# EasyEDA schematic N2onboardTelemetry.json

## Sheets
1 Connectors: TITLE: Connectors; REV: 1.0; Date: 2022-01-05; Sheet: 1/1; Company: Nakuja
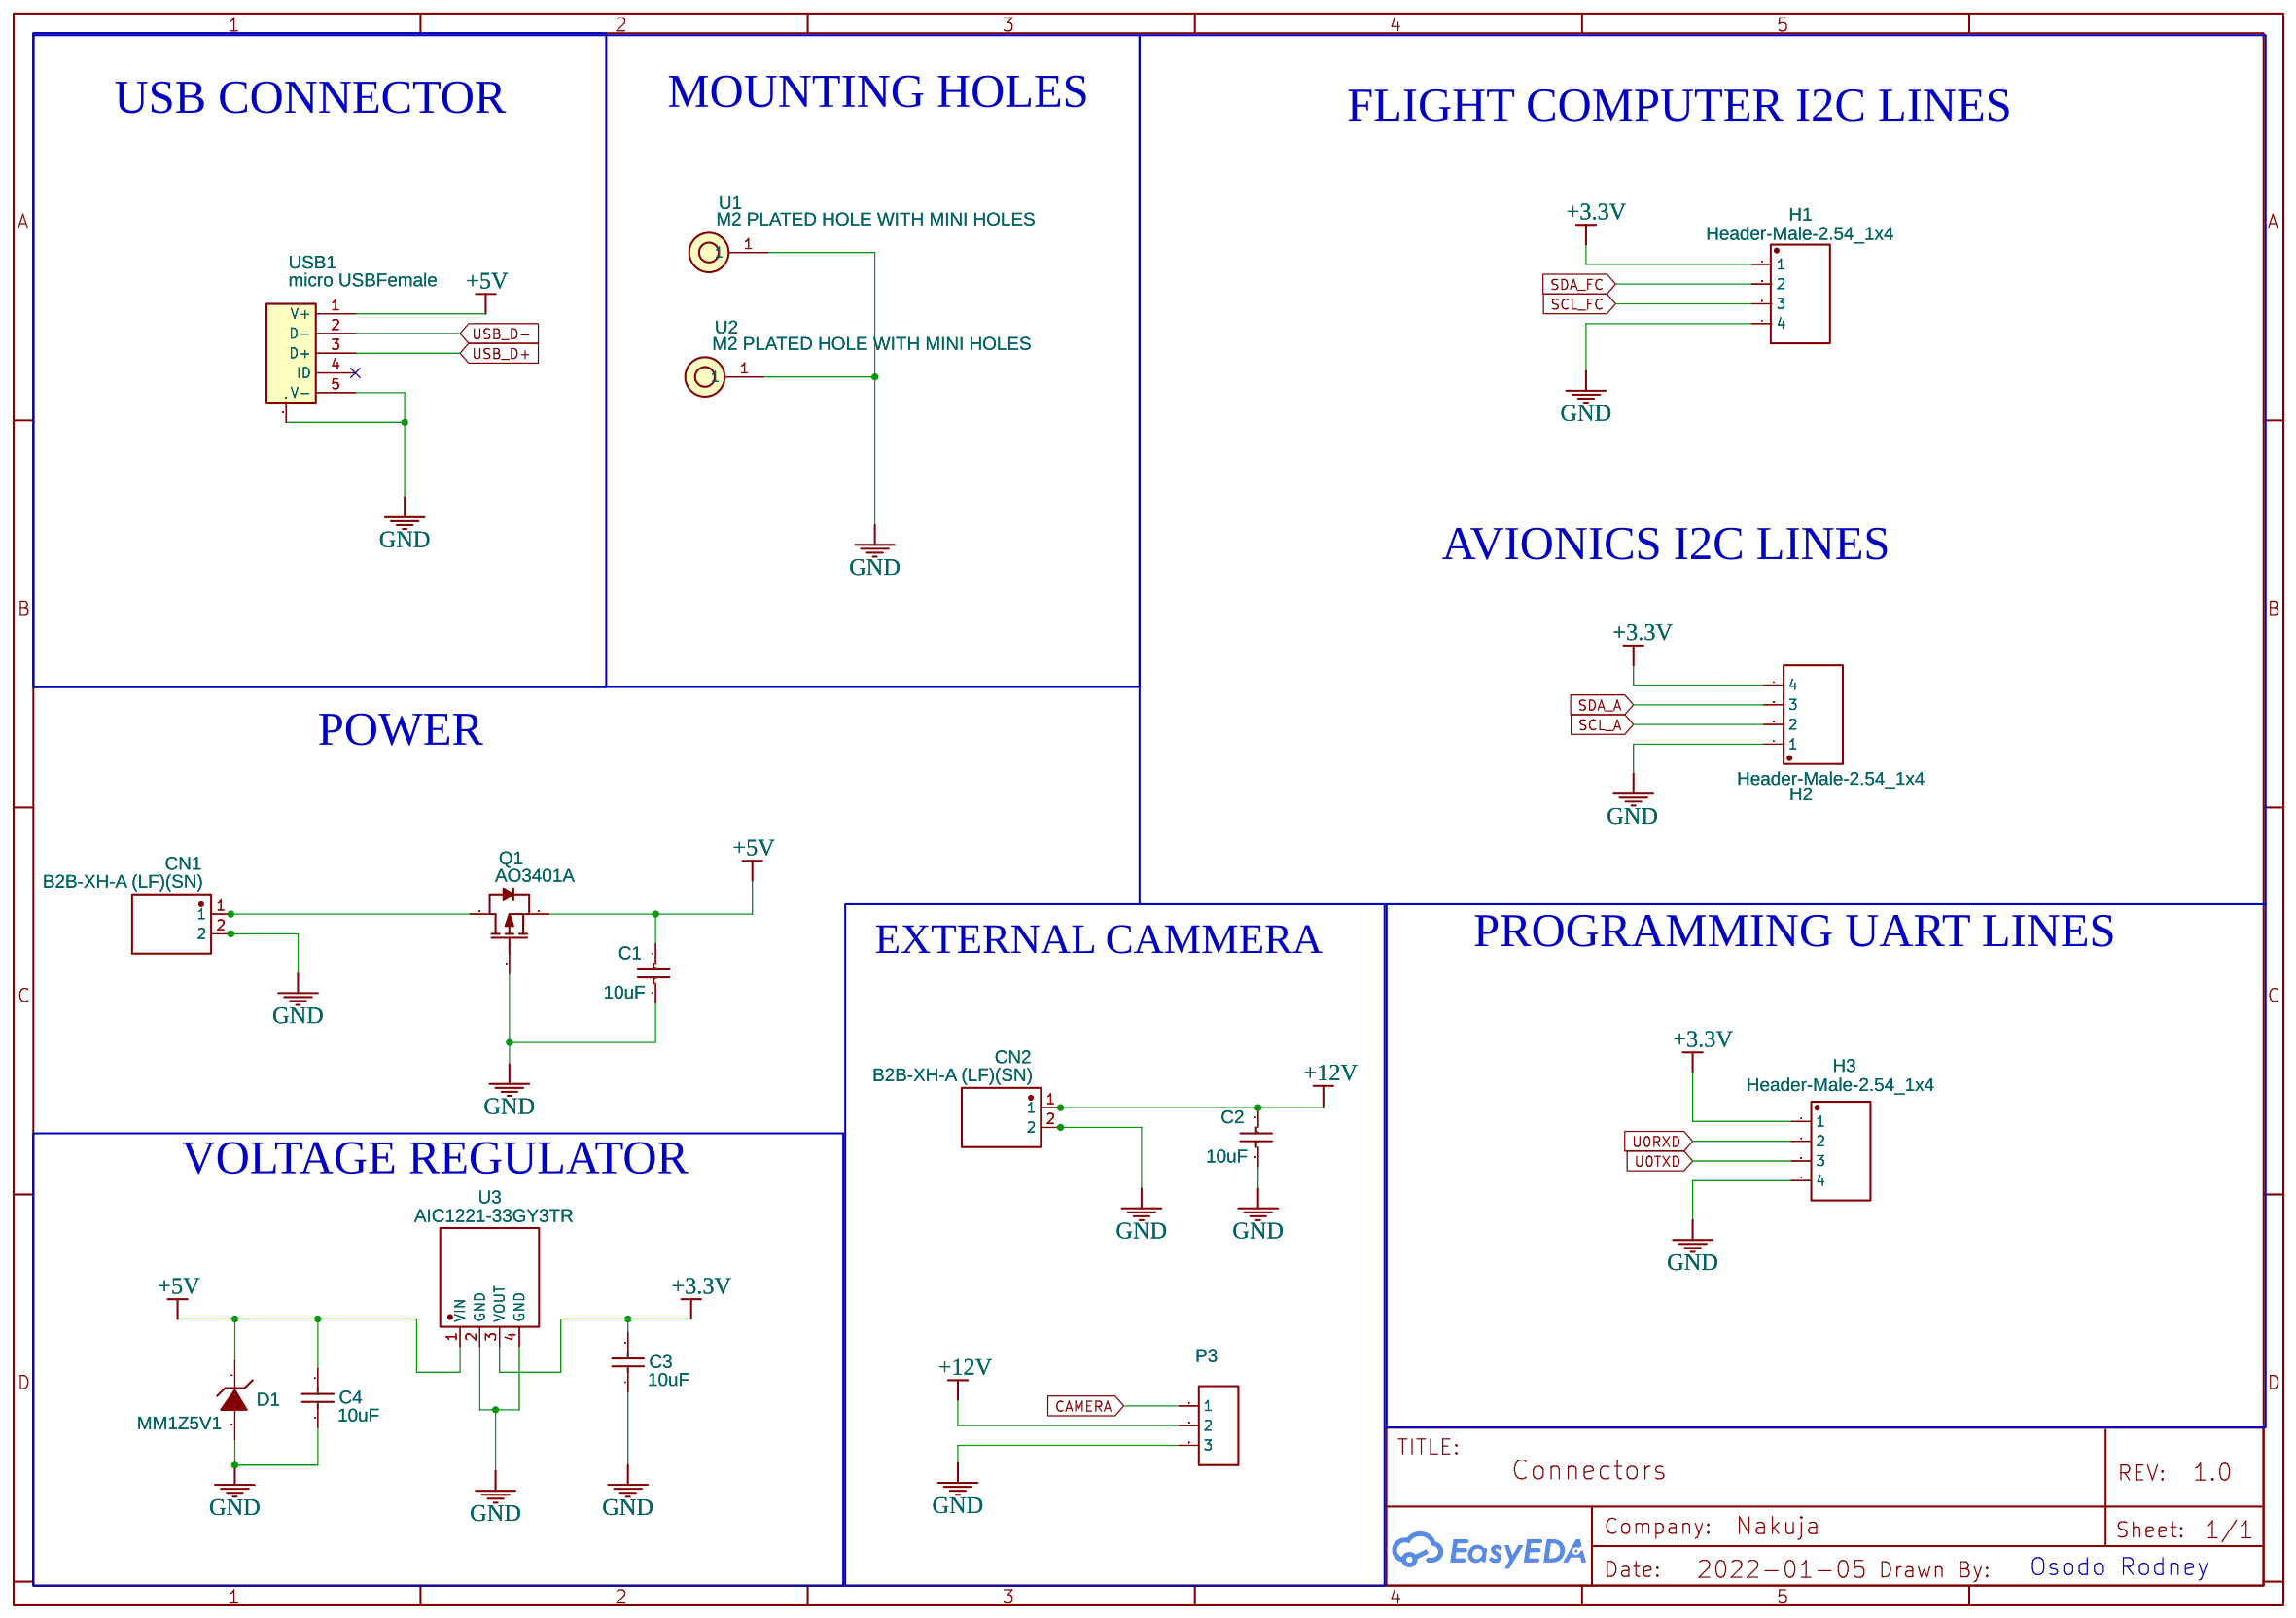
[diagram p0: Connectors]
2 lora&storage: TITLE: Lora and Storage; Date: 2022-02-04; Drawn By: Rodney Osodo
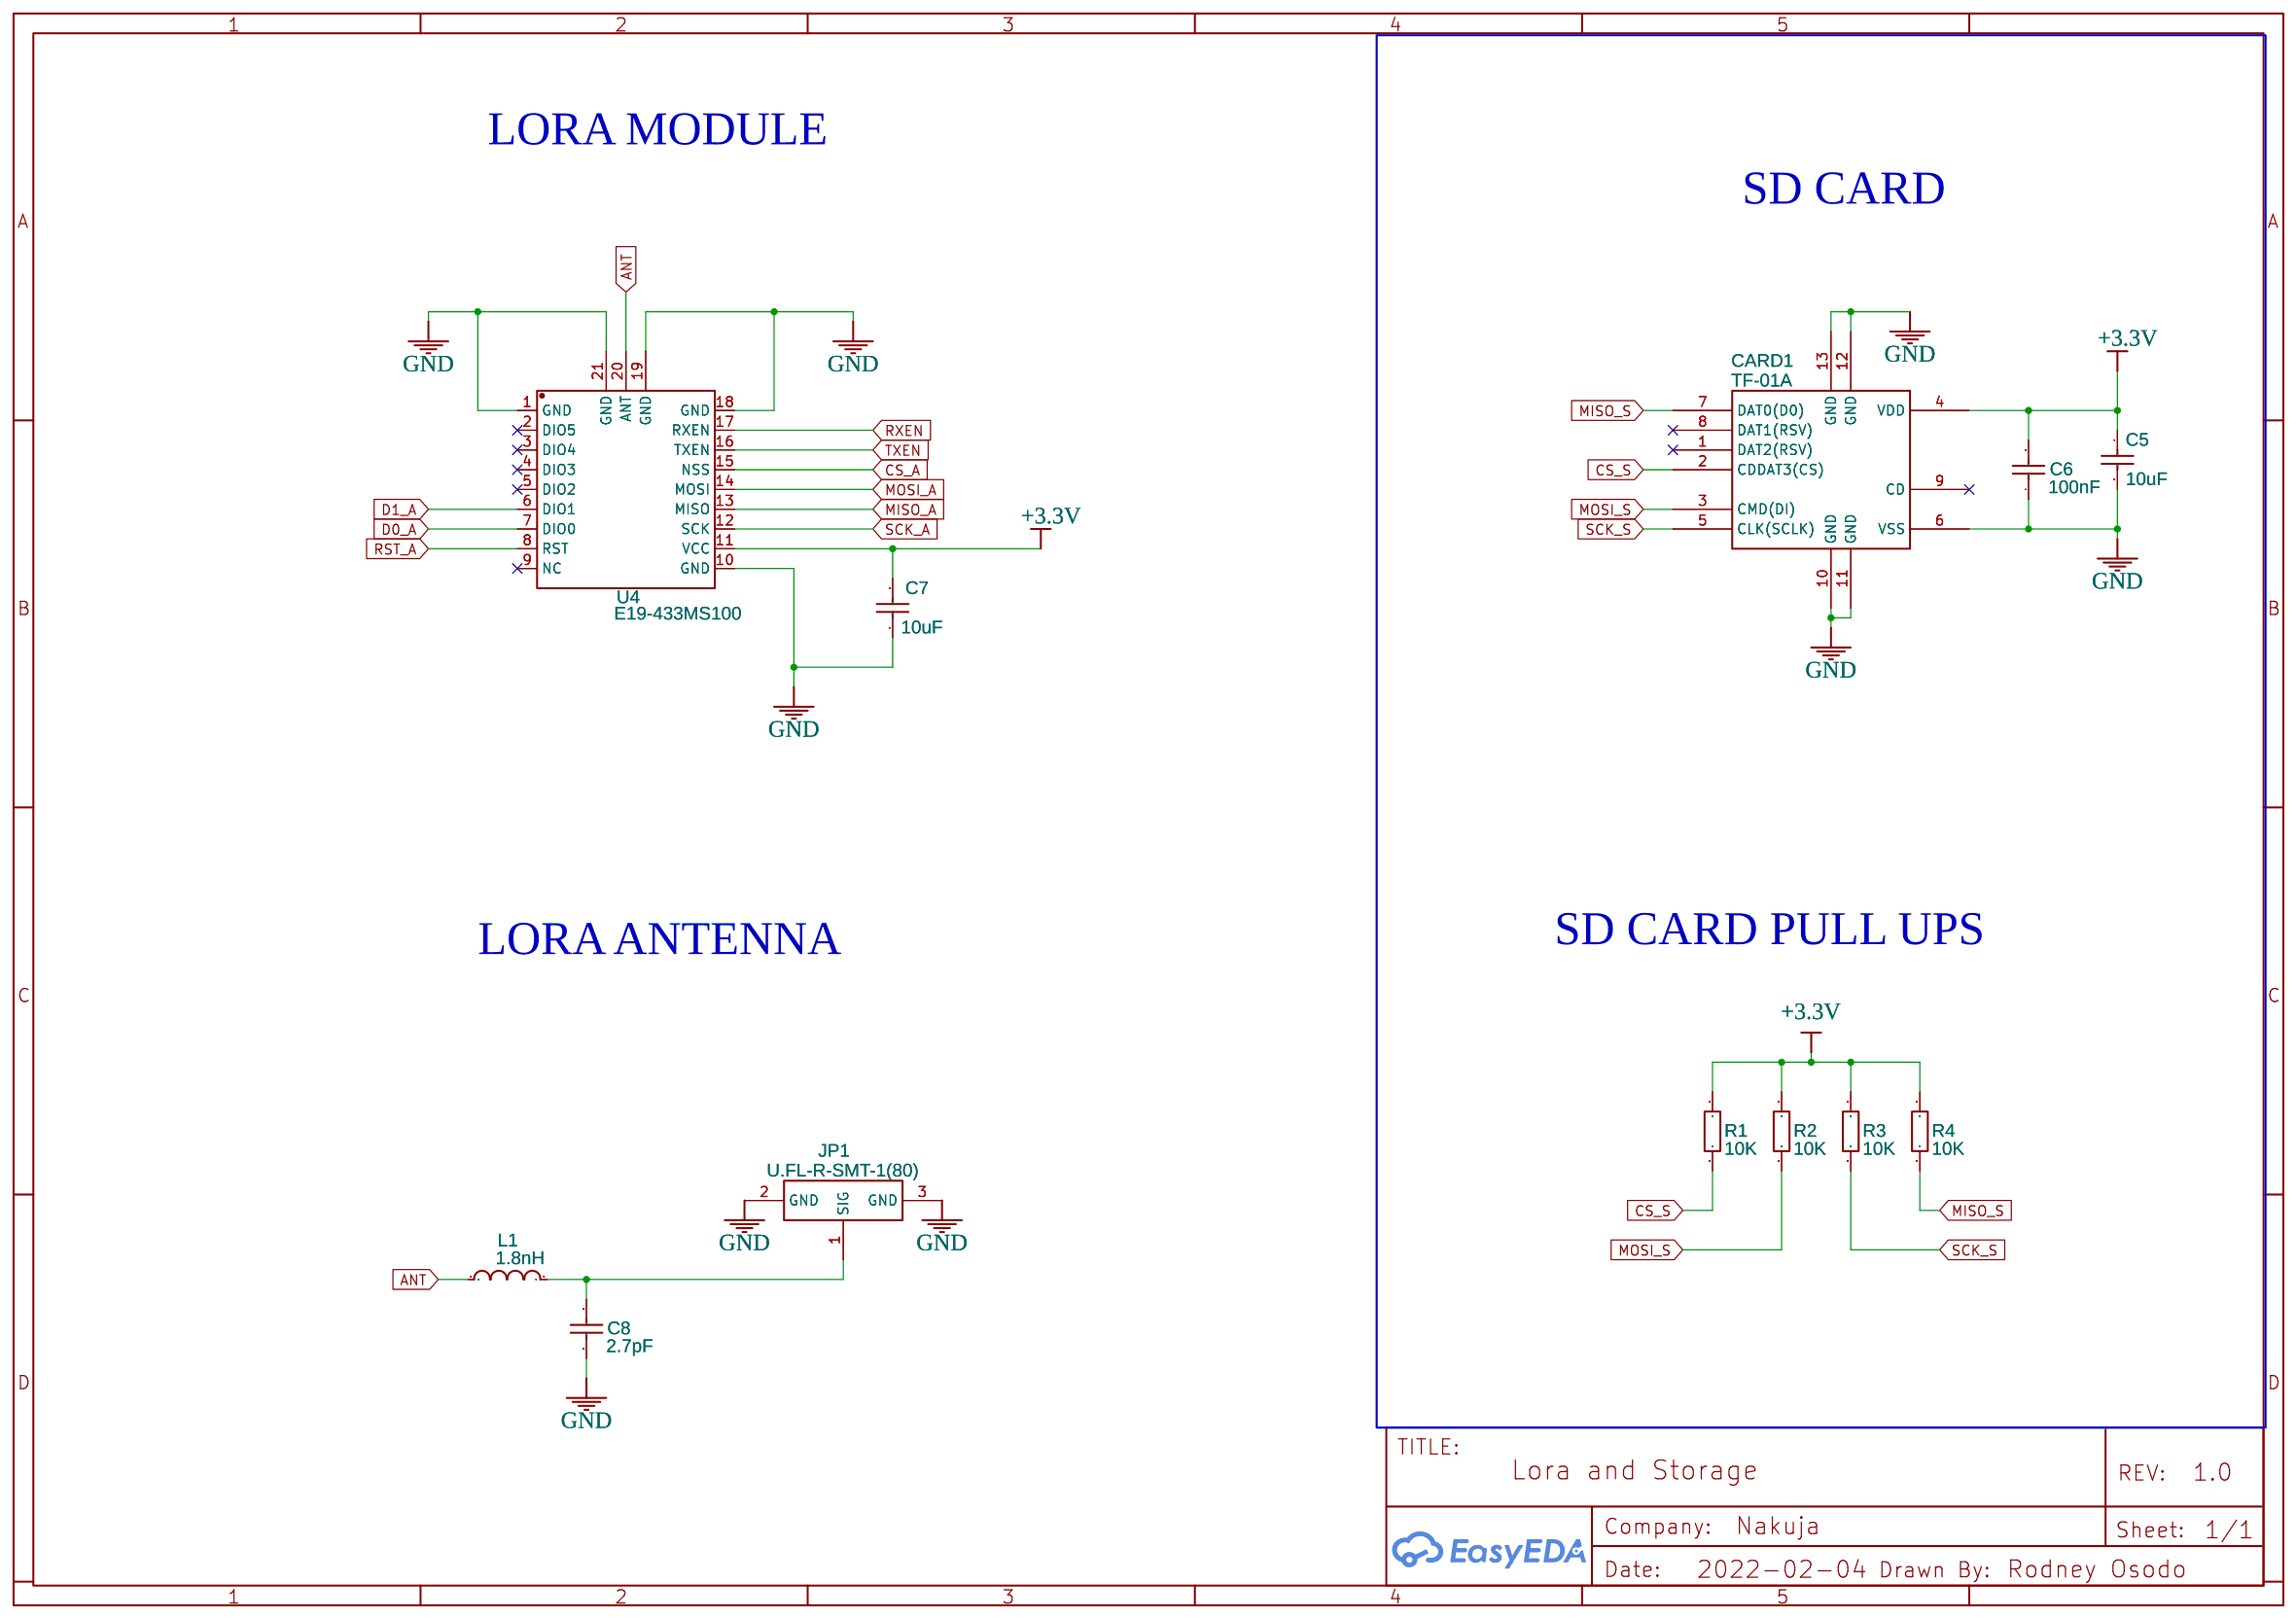
[diagram p1: lora&storage]
3 Peripherals: TITLE: MCU; Date: 2022-02-04; Drawn By: Rodney Osodo
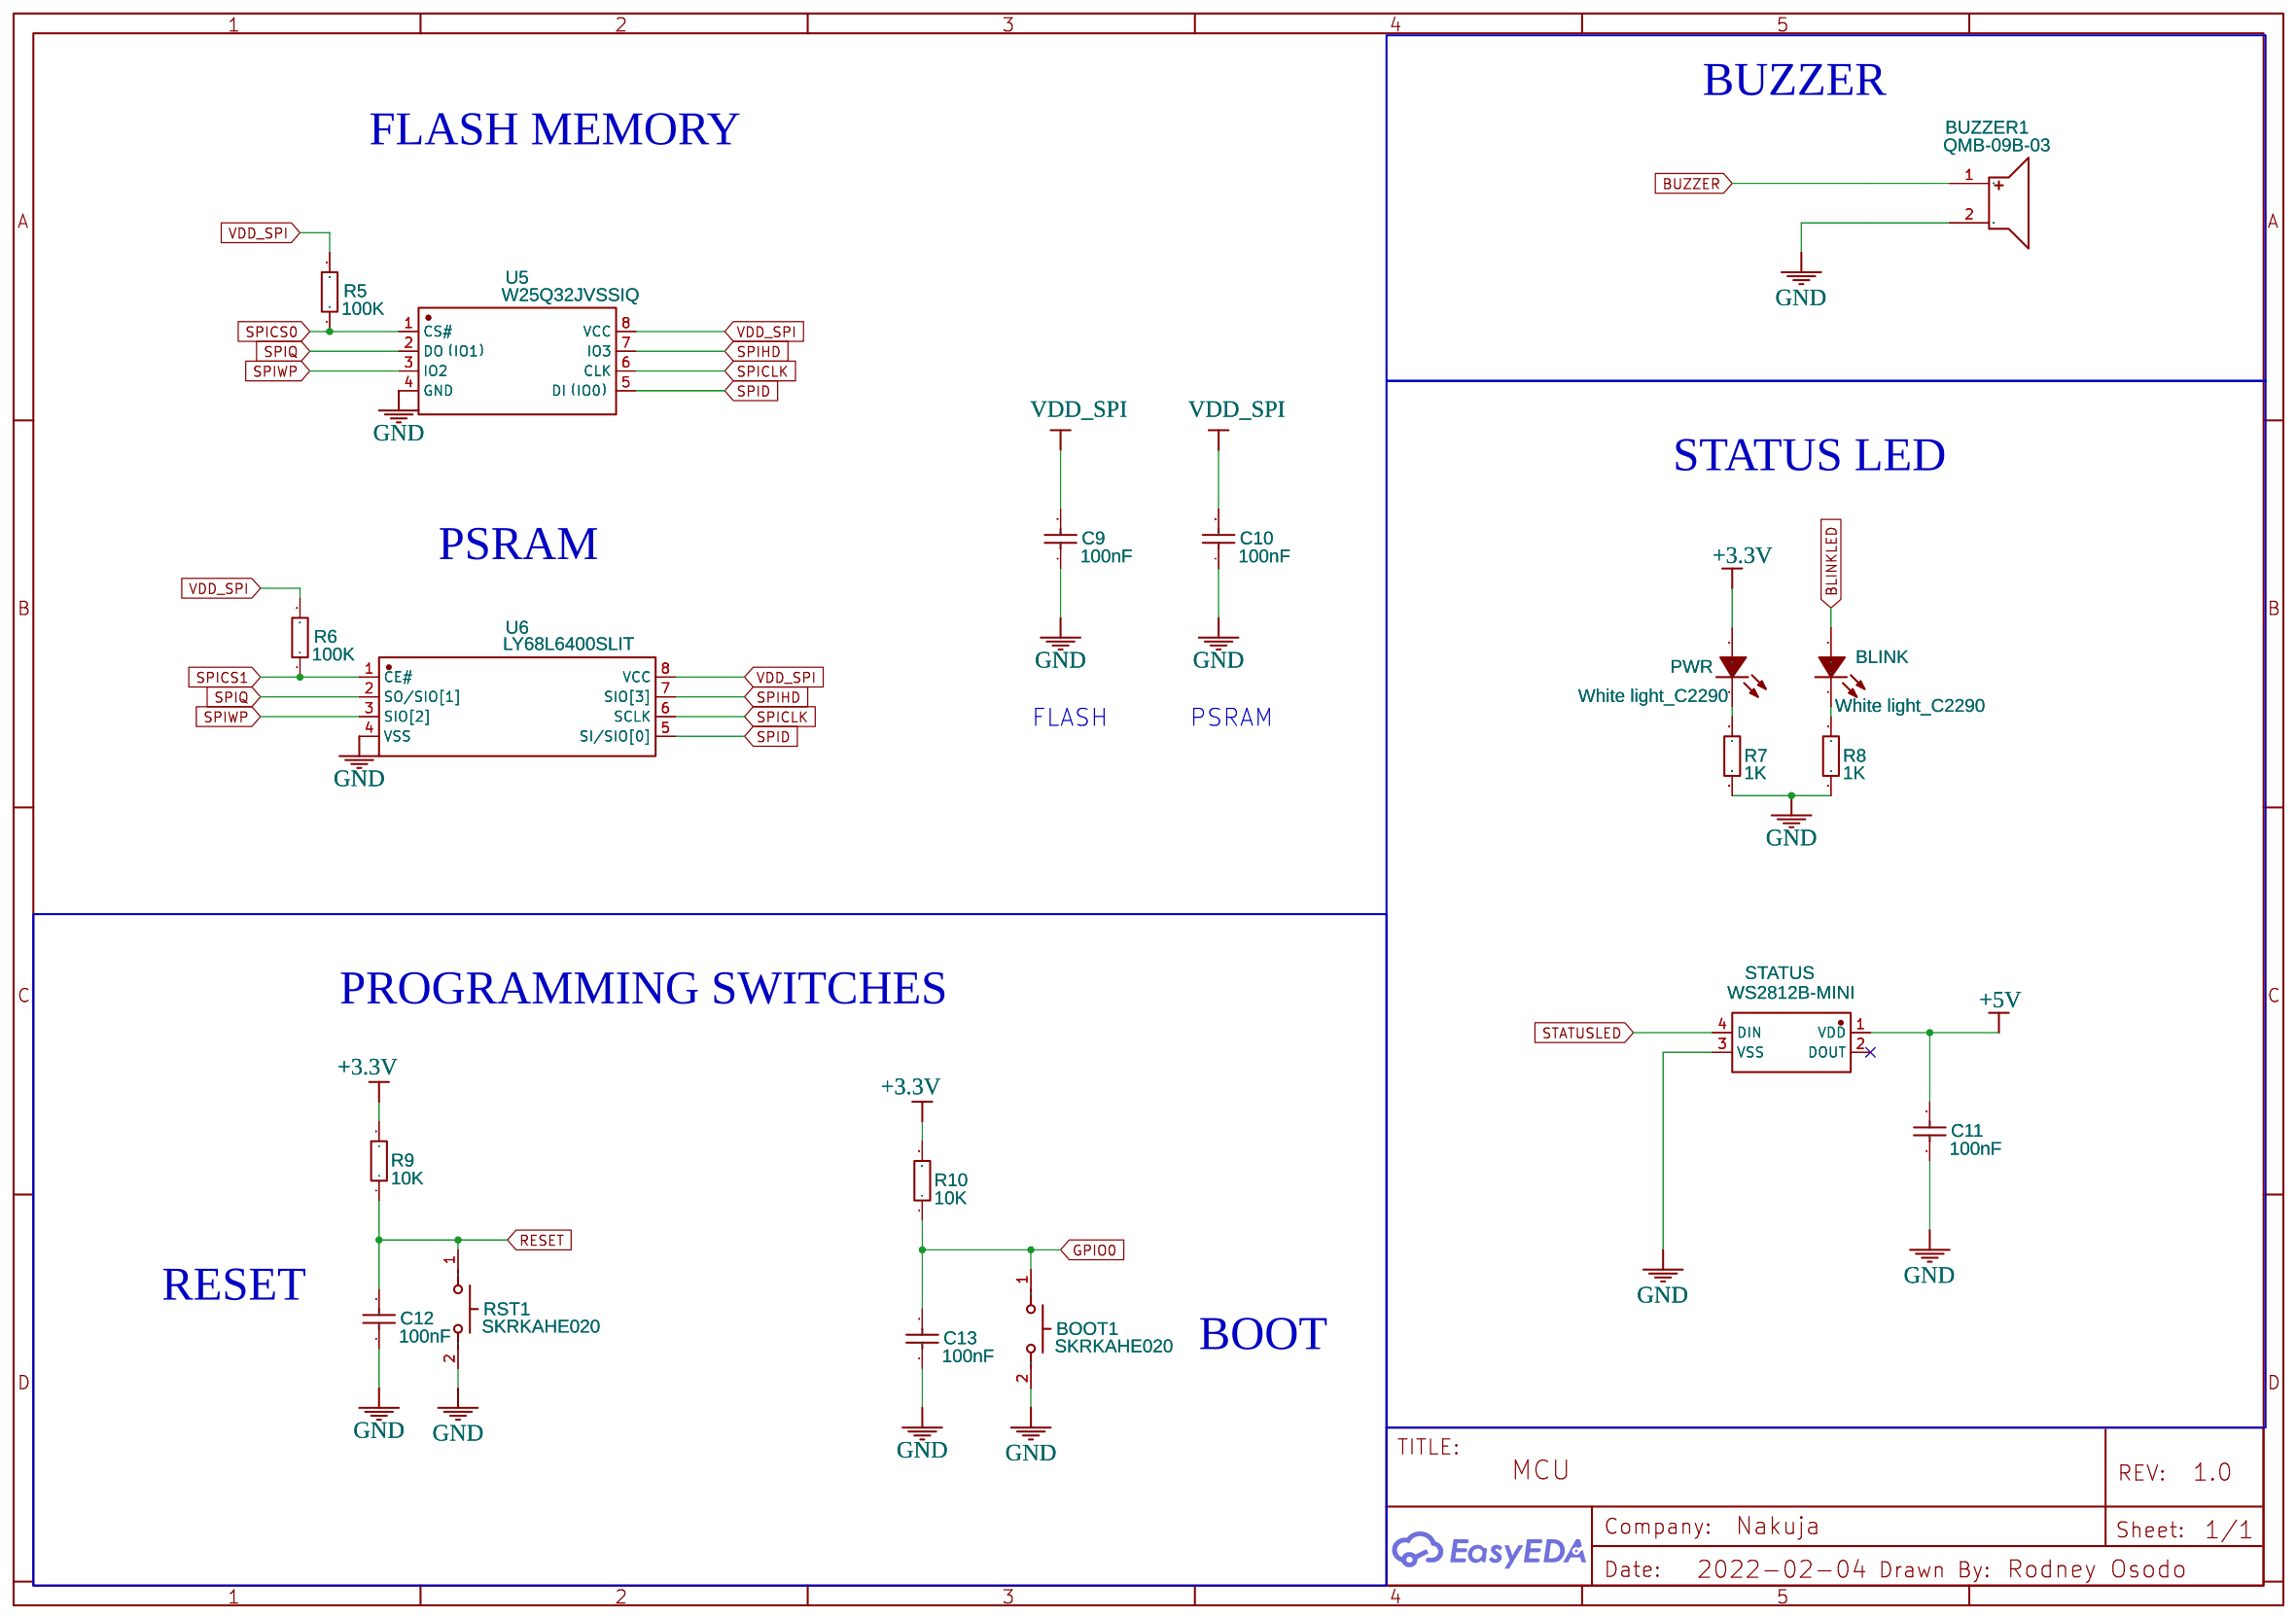
[diagram p2: Peripherals]
4 MCU: TITLE: Sheet_1; Date: 2022-03-04; Company: Your Company
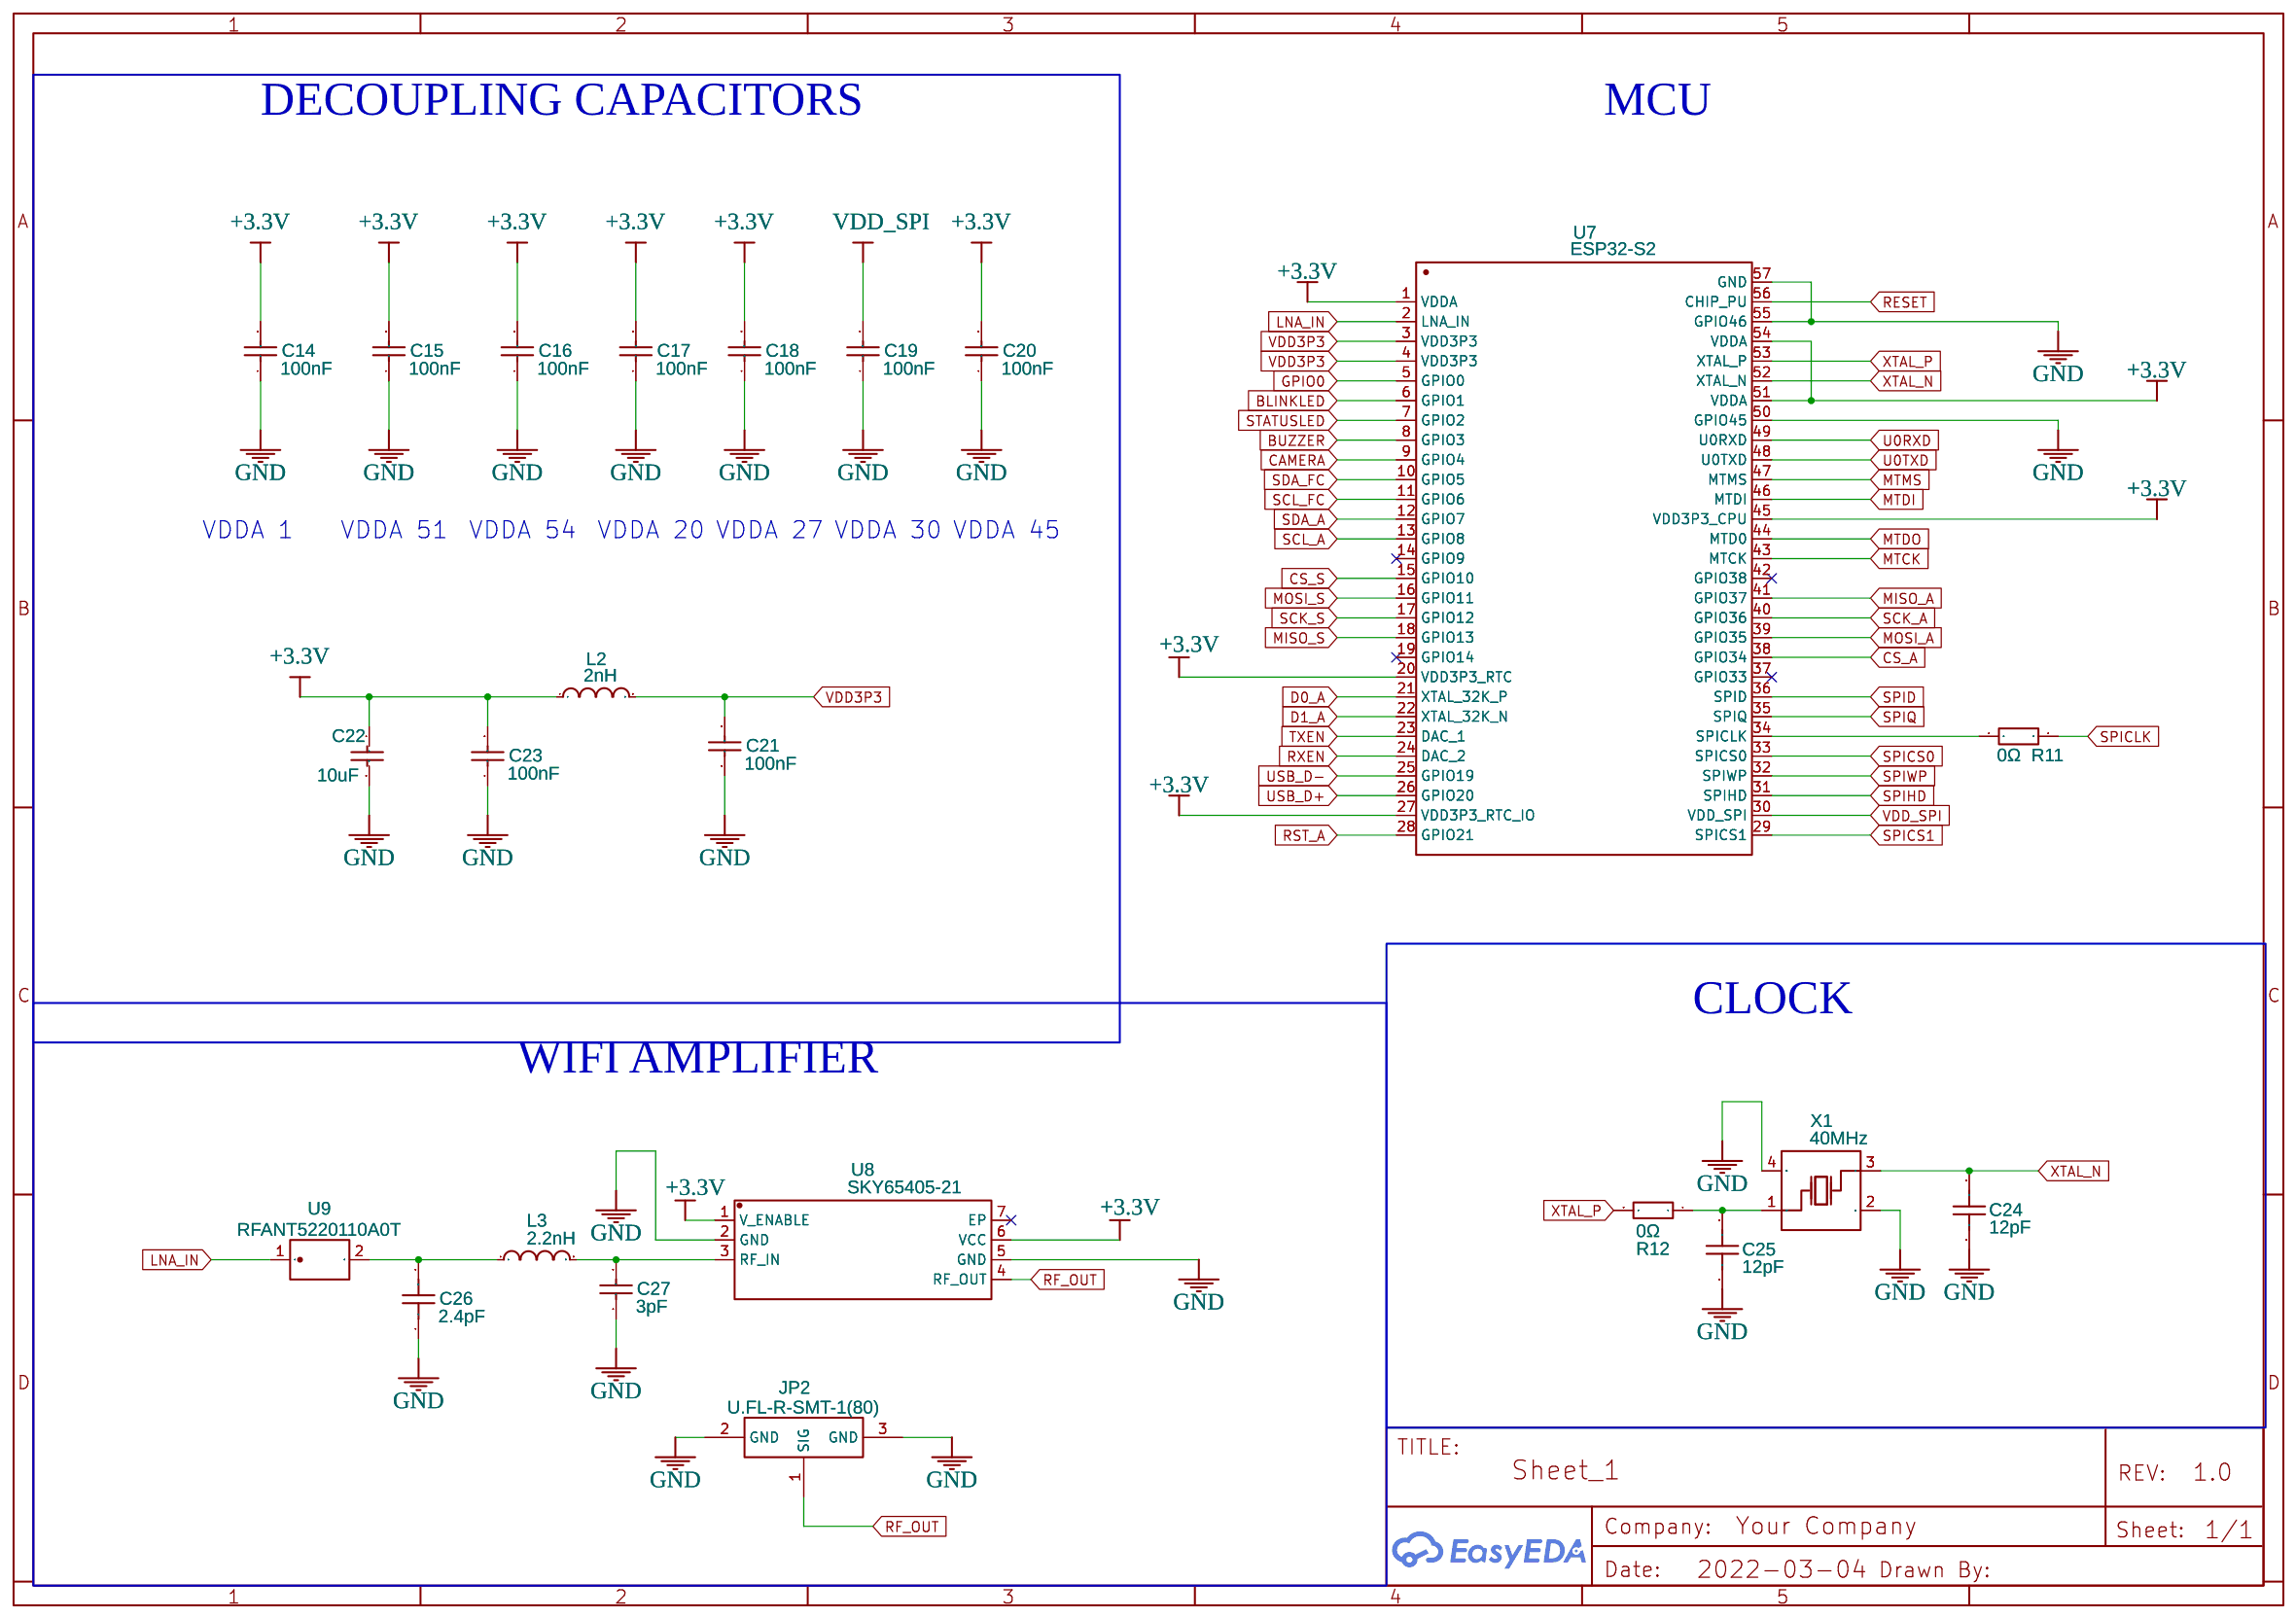
[diagram p3: MCU]
5 Debug: TITLE: Debug; Date: 2022-03-06; Drawn By: Rodney Osodo; Company: Your Company
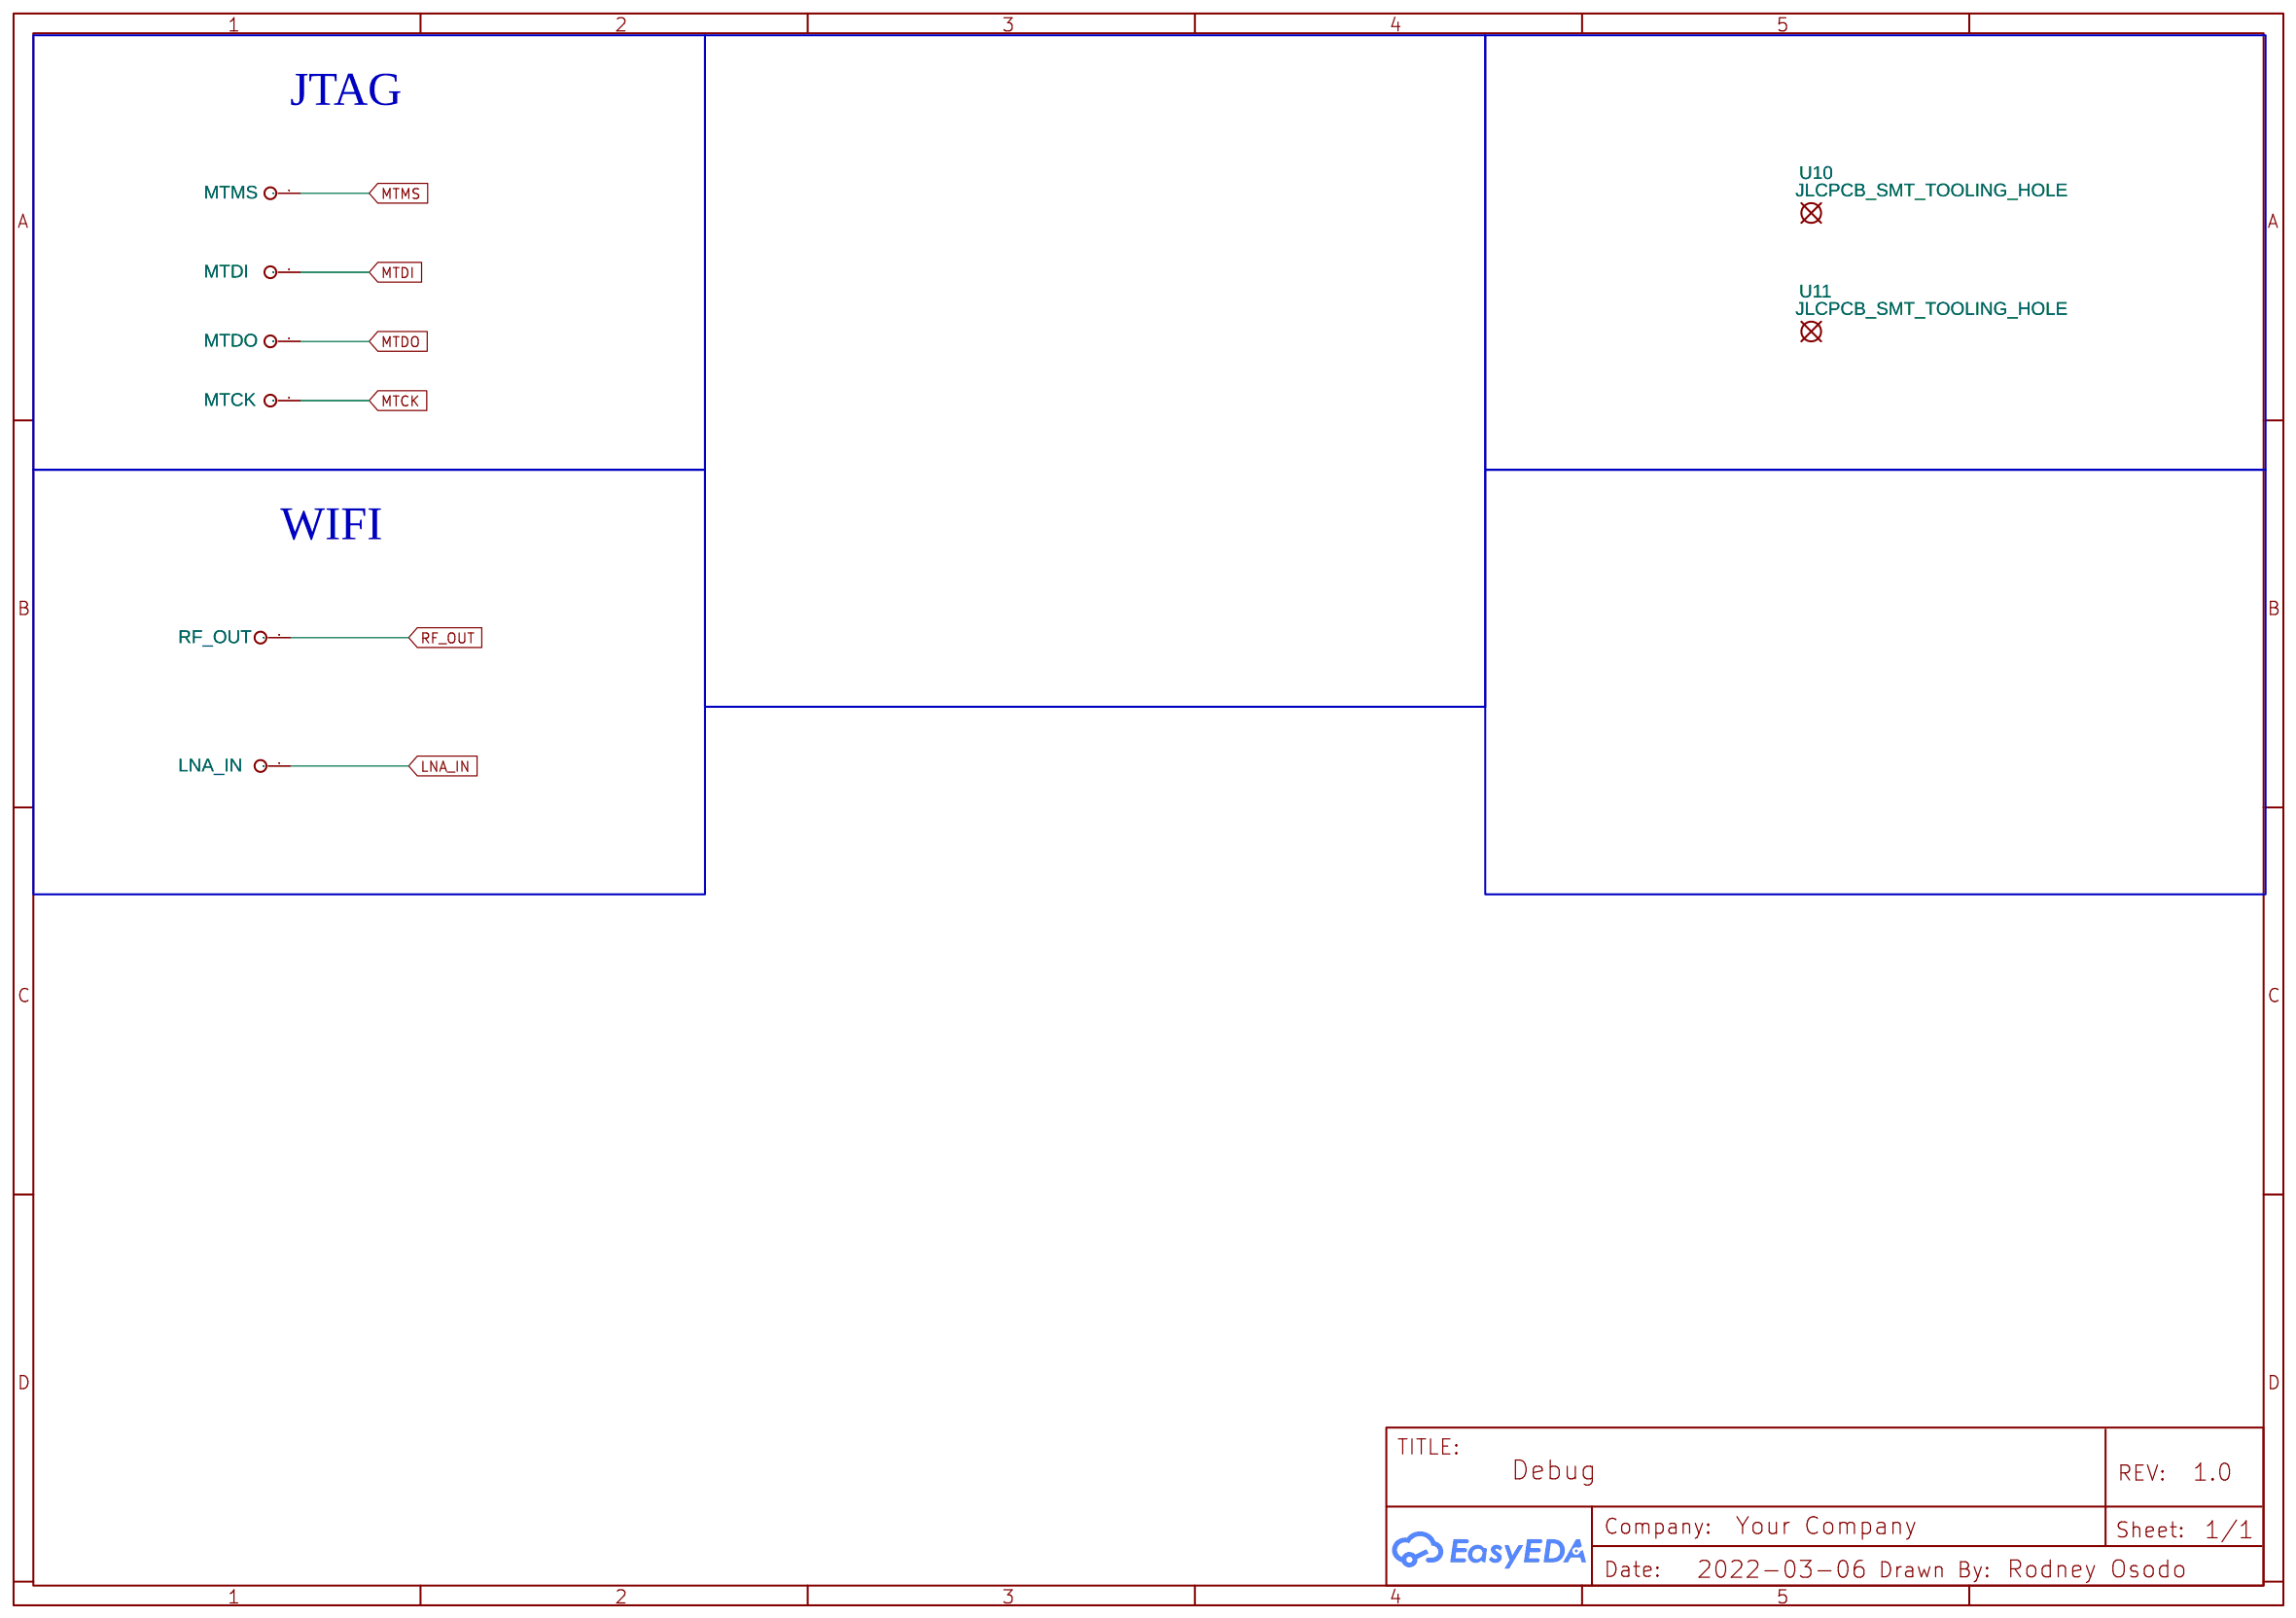
[diagram p4: Debug]

## Parts
sheet Connectors
C1  10uF  [C0402]
C2  10uF  [C0402]
C3  10uF  [C0402]
C4  10uF  [C0402]
CN1  B2B-XH-A (LF)(SN)  [CONN-TH_B2B-XH-A-LF-SN]
CN2  B2B-XH-A (LF)(SN)  [CONN-TH_B2B-XH-A-LF-SN]
D1  MM1Z5V1  [SOD-123_L2.7-W1.6-LS3.7-RD]
H1  Header-Male-2.54_1x4  [HDR-TH_4P-P2.54-V-M]
H2  Header-Male-2.54_1x4  [HDR-TH_4P-P2.54-V-M]
H3  Header-Male-2.54_1x4  [HDR-TH_4P-P2.54-V-M]
P3  HEADER-PINS_2.54_03PIN_01ROW COPY  [HEADER-PINS_2.54_04PIN_01ROW]
Q1  AO3401A  [SOT-23_L2.9-W1.3-P1.90-LS2.4-BR]
U1  M2 PLATED HOLE WITH MINI HOLES  [M2 PLATED HOLE WITH MINI HOLES]
U2  M2 PLATED HOLE WITH MINI HOLES  [M2 PLATED HOLE WITH MINI HOLES]
U3  AIC1221-33GY3TR  [SOT-223_L6.5-W3.5-P2.30-LS7.0-BR]
USB1  micro USBFemale  [MICRO-USB-SMD_5P-P0.65-H-F_C10418]
sheet Debug
LNA_IN  TESTPOINT_1MM  [TESTPOINT_1MM]
MTCK  TESTPOINT_1MM  [TESTPOINT_1MM]
MTDI  TESTPOINT_1MM  [TESTPOINT_1MM]
MTDO  TESTPOINT_1MM  [TESTPOINT_1MM]
MTMS  TESTPOINT_1MM  [TESTPOINT_1MM]
RF_OUT  TESTPOINT_1MM  [TESTPOINT_1MM]
U10  JLCPCB_SMT_TOOLING_HOLE  [JLCPCB_SMT_TOOLING_HOLE]
U11  JLCPCB_SMT_TOOLING_HOLE  [JLCPCB_SMT_TOOLING_HOLE]
sheet lora&storage
C5  10uF  [C0402]
C6  100nF  [C0402_NEW]
C7  10uF  [C0402]
C8  2.7pF  [C0402]
CARD1  TF-01A  [TF-SMD_TF-01A]
JP1  U.FL-R-SMT-1(80)  [RF-SMD_734120114]
L1  1.8nH  [L0402]
R1  10K  [R0402]
R2  10K  [R0402]
R3  10K  [R0402]
R4  10K  [R0402]
U4  E19-433MS100  [WIRELM-SMD_E19-433M20SC]
sheet MCU
C14  100nF  [C0402_NEW]
C15  100nF  [C0402_NEW]
C16  100nF  [C0402_NEW]
C17  100nF  [C0402_NEW]
C18  100nF  [C0402_NEW]
C19  100nF  [C0402_NEW]
C20  100nF  [C0402_NEW]
C21  100nF  [C0402_NEW]
C22  10uF  [C0402]
C23  100nF  [C0402_NEW]
C24  12pF  [C0402]
C25  12pF  [C0402]
C26  2.4pF  [C0402]
C27  3pF  [C0402]
JP2  U.FL-R-SMT-1(80)  [RF-SMD_734120114]
L2  2nH  [L0402]
L3  2.2nH  [L0402]
R11  0Ω  [R0402]
R12  0Ω  [R0402]
U7  ESP32-S2  [QFN-56_L7.0-W7.0-P0.40-TL-EP4.0]
U8  SKY65405-21  [DFN-6_L1.5-W1.5-P0.50-BL-EP1.2]
U9  RFANT5220110A0T  [FILTER-SMD_L5.2-W2.0-L]
X1  40MHz  [CRYSTAL-SMD_4P-L3.2-W2.5-BL]
sheet Peripherals
BLINK  White light_C2290  [LED0603-R-RD_WHITE]
BOOT1  SKRKAHE020  [SW-SMD_L3.9-W3.0-P4.45]
BUZZER1  QMB-09B-03  [BUZ-TH_BD9.0-P4.00-D0.6-FD]
C9  100nF  [C0402_NEW]
C10  100nF  [C0402_NEW]
C11  100nF  [C0402_NEW]
C12  100nF  [C0402_NEW]
C13  100nF  [C0402_NEW]
PWR  White light_C2290  [LED0603-R-RD_WHITE]
R5  100K  [R0402]
R6  100K  [R0402]
R7  1K  [R0402]
R8  1K  [R0402]
R9  10K  [R0402]
R10  10K  [R0402]
RST1  SKRKAHE020  [SW-SMD_L3.9-W3.0-P4.45]
STATUS  WS2812B-MINI  [LED-SMD_4P-L3.5-W3.5-TL_WS2812B]
U5  W25Q32JVSSIQ  [SOIC-8_L5.3-W5.3-P1.27-LS8.0-BL]
U6  LY68L6400SLIT  [SOP-8_L4.9-W3.9-P1.27-LS6.0-BL]

## Library data of the parts
C1 C2 C5 C7 C22 = CL05A106MQ5NUNC: Supplier: LCSC; Manufacturer: SAMSUNG; Supplier Part: C15525; SMT Type: Basic; JLCPCB SMD: Yes; LCSC Assembly: Yes; Paste Type: base
C3 C4 = CL05A106MQ5NUNC: Supplier: LCSC; Manufacturer: SAMSUNG; Supplier Part: C15525; JLCPCB Part Class: Basic Part
CN1 CN2 = B2B-XH-A (LF)(SN): Supplier: LCSC; Supplier Part: C158012; Manufacturer: JST Sales America; Contributor: LCSC; JLCPCB Part Class: Extended Part
D1 = MM1Z5V1: Supplier: LCSC; Manufacturer: SEMTECH; Supplier Part: C81601; JLCPCB Part Class: Extended Part
H1-H3 = Header-Male-2.54_1x4: Supplier: LCSC; Manufacturer: Ckmtw; Manufacturer Part: 210S-1*4P L=11.6MMGold-plated black; Contributor: LCSC; Supplier Part: C124378; JLCPCB Part Class: Extended Part
P3 = HEADER-PINS_2.54_03PIN_01ROW COPY: Contributor: FTI-Pilatus-Aircraft
Q1 = AO3401A: Supplier: LCSC; Manufacturer: AOS; Supplier Part: C15127; JLCPCB Part Class: Basic Part
U1 U2 = M2 PLATED HOLE WITH MINI HOLES: Contributor: Andrew Young
U3 = AIC1221-33GY3TR: Supplier: LCSC; Supplier Part: C211622; Manufacturer: Analog Integrations; Contributor: LCSC; JLCPCB Part Class: Extended Part
USB1 = micro USBFemale: Supplier: LCSC; Manufacturer: ValuePro; Supplier Part: C10418; JLCPCB Part Class: Extended Part
LNA_IN MTCK MTDI MTDO MTMS RF_OUT = TESTPOINT_1MM: Contributor: LCSC
U10 U11 = JLCPCB_SMT_TOOLING_HOLE: Supplier: LCSC; Contributor: yjzhang
C6 C9-C21 C23 = CL05B104KO5NNNC: Supplier: LCSC; Manufacturer: SAMSUNG; Supplier Part: C1525; JLCPCB Part Class: Basic Part
C8 = 0402CG2R7C500NT: Supplier: LCSC; Manufacturer: FH; Supplier Part: C1561; JLCPCB Part Class: Basic Part
CARD1 = TF-01A: Supplier: LCSC; Manufacturer: HRO; Supplier Part: C91145; JLCPCB Part Class: Extended Part
JP1 JP2 = U.FL-R-SMT-1(80): Supplier: LCSC; Manufacturer: HRS; Supplier Part: C88374; JLCPCB Part Class: Extended Part
L1 = HK10051N8S-T: Supplier: LCSC; Manufacturer: TAIYO YUDEN; Supplier Part: C89157
R1-R4 R9 R10 = RTT02103JTH: Supplier: LCSC; Manufacturer: RALEC; Supplier Part: C102759; JLCPCB Part Class: Extended Part
U4 = E19-433MS100: Supplier: LCSC; Supplier Part: C97346; Manufacturer: Chengdu Ebyte Elec Tech; Contributor: LCSC; JLCPCB Part Class: Extended Part
C24 C25 = 0402N120F500CT: Supplier: LCSC; Supplier Part: C555399; Manufacturer: Walsin Tech Corp; Contributor: LCSC
C26 = 0402N2R4B500: Supplier: LCSC; Supplier Part: C123475; Manufacturer: Huaxin S&T; Contributor: LCSC; JLCPCB Part Class: Extended Part
C27 = CL05C030BB5NNNC: Supplier: LCSC; Supplier Part: C318583; Manufacturer: Samsung Electro-Mechanics; Contributor: LCSC; JLCPCB Part Class: Extended Part
L2 = MLG1005S2N0BT000: Supplier: LCSC; Supplier Part: C76769; Manufacturer: TDK; Contributor: LCSC; JLCPCB Part Class: Extended Part
L3 = SDCL1005C2N2STDF: Supplier: LCSC; Manufacturer: Sunlord; Supplier Part: C27122; JLCPCB Part Class: Extended Part
R11 R12 = RC-02000FT: Supplier: LCSC; Supplier Part: C140225; Manufacturer: Guangdong Fenghua Advanced Tech; Resistance (Ohms): 0; Contributor: LCSC; JLCPCB Part Class: Extended Part
U7 = ESP32-S2: Supplier: LCSC; Supplier Part: C529594; Manufacturer: ESPRESSIF 乐鑫; Contributor: LCSC; JLCPCB Part Class: Extended Part
U8 = SKY65405-21: Supplier: LCSC; Supplier Part: C80314; Manufacturer: Skyworks Solutions; Contributor: LCSC; JLCPCB Part Class: Extended Part
U9 = RFANT5220110A0T: Supplier: LCSC; Supplier Part: C127611; Manufacturer: Walsin Tech Corp; Frequency: 2.4GHz; Contributor: LCSC; JLCPCB Part Class: Extended Part
X1 = S3240000121040: Supplier: LCSC; Supplier Part: C426989; Manufacturer: JGHC; Contributor: LCSC; JLCPCB Part Class: Extended Part
BLINK PWR = 0603White light_C2290: Supplier: LCSC; Manufacturer: KENTO; Manufacturer Part: 0603White light; Supplier Part: C2290; JLCPCB Part Class: Basic Part
BOOT1 RST1 = SKRKAHE020: Supplier: LCSC; Supplier Part: C202388; Manufacturer: ALPS Electric; Contributor: LCSC
BUZZER1 = QMB-09B-03: Supplier: LCSC; Manufacturer: HNDZ; Contributor: LCSC; Supplier Part: C96256; JLCPCB Part Class: Extended Part
R5 R6 = 0402WGF1003TCE: Supplier: LCSC; Manufacturer: UniOhm; Supplier Part: C25741; JLCPCB Part Class: Basic Part
R7 R8 = 0402WGF5101TCE: Supplier: LCSC; Manufacturer: UniOhm; Supplier Part: C25905; JLCPCB Part Class: Basic Part
STATUS = WS2812B-MINI: Supplier: LCSC; Supplier Part: C527089; Manufacturer: Worldsemi; Manufacturer Part: WS2812B-Mini; Contributor: LCSC; JLCPCB Part Class: Extended Part
U5 = W25Q32JVSSIQ: Supplier: LCSC; Manufacturer: WINBOND; Supplier Part: C82344; JLCPCB Part Class: Extended Part
U6 = LY68L6400SLIT: Supplier: LCSC; Supplier Part: C261881; Manufacturer: Lyontek Inc.; Contributor: LCSC; JLCPCB Part Class: Extended Part

## Nets
+3.3V: C3.2 C5.1 C6.2 C7.1 C14.2 C15.2 C16.2 C17.2 C18.2 C20.2 C22.1 C23.2 CARD1.4(VDD) H1.1 H2.4 H3.1 L2.1 PWR.1(A) R1.2 R2.2 R3.2 R4.2 R9.2 R10.2 U3.3(VOUT) U4.11(VCC) U7.1(VDDA) U7.20(VDD3P3_RTC) U7.27(VDD3P3_RTC_IO) U7.45(VDD3P3_CPU) U7.51(VDDA) U7.54(VDDA) U8.1(V_ENABLE) U8.6(VCC)
+5V: C1.1 C4.2 C11.2 D1.1(C) Q1.2(S) STATUS.1(VDD) U3.1(VIN) USB1.1(V+)
+12V: C2.1 CN2.1 P3.2
GND: BOOT1.2 BUZZER1.2 C1.2 C2.2 C3.1 C4.1 C5.2 C6.1 C7.2 C8.1 C9.1 C10.1 C11.1 C12.1 C13.1 C14.1 C15.1 C16.1 C17.1 C18.1 C19.1 C20.1 C21.1 C22.2 C23.1 C24.1 C25.1 C26.1 C27.1 CARD1.6(VSS) CARD1.10(GND) CARD1.11(GND) CARD1.12(GND) CARD1.13(GND) CN1.2 CN2.2 D1.2(A) H1.4 H2.1 H3.4 JP1.2(GND) JP1.3(GND) JP2.2(GND) JP2.3(GND) P3.3 Q1.1(G) R7.2 R8.1 RST1.2 STATUS.3(VSS) U1.1 U2.1 U3.2(GND) U3.4(GND) U4.1(GND) U4.10(GND) U4.18(GND) U4.19(GND) U4.21(GND) U5.4(GND) U6.4(VSS) U7.50(GPIO45) U7.55(GPIO46) U7.57(GND) U8.2(GND) U8.5(GND) USB1.0(MTN) USB1.5(V-) X1.2(GND) X1.4(GND)
VDD3P3: C21.2 L2.2 U7.3(VDD3P3) U7.4(VDD3P3)
VDD_SPI: C9.2 C10.2 C19.2 R5.2 R6.2 U5.8(VCC) U6.8(VCC) U7.30(VDD_SPI)
ANT: L1.1 U4.20(ANT)
BLINKLED: BLINK.1(A) U7.6(GPIO1)
BUZZER: BUZZER1.1 U7.8(GPIO3)
CAMERA: P3.1 U7.9(GPIO4)
CS_A: U4.15(NSS) U7.38(GPIO34)
CS_S: CARD1.2(CDDAT3(CS)) R1.1 U7.15(GPIO10)
D0_A: U4.7(DIO0) U7.21(XTAL_32K_P)
D1_A: U4.6(DIO1) U7.22(XTAL_32K_N)
GPIO0: BOOT1.1 C13.2 R10.1 U7.5(GPIO0)
LNA_IN: LNA_IN.1 U7.2(LNA_IN) U9.1
MISO_A: U4.13(MISO) U7.41(GPIO37)
MISO_S: CARD1.7(DAT0(D0)) R4.1 U7.18(GPIO13)
MOSI_A: U4.14(MOSI) U7.39(GPIO35)
MOSI_S: CARD1.3(CMD(DI)) R2.1 U7.16(GPIO11)
MTCK: MTCK.1 U7.43(MTCK)
MTDI: MTDI.1 U7.46(MTDI)
MTDO: MTDO.1 U7.44(MTD0)
MTMS: MTMS.1 U7.47(MTMS)
RESET: C12.2 R9.1 RST1.1 U7.56(CHIP_PU)
RF_OUT: JP2.1(SIG) RF_OUT.1 U8.4(RF_OUT)
RST_A: U4.8(RST) U7.28(GPIO21)
RXEN: U4.17(RXEN) U7.24(DAC_2)
SCK_A: U4.12(SCK) U7.40(GPIO36)
SCK_S: CARD1.5(CLK(SCLK)) R3.1 U7.17(GPIO12)
SCL_A: H2.2 U7.13(GPIO8)
SCL_FC: H1.3 U7.11(GPIO6)
SDA_A: H2.3 U7.12(GPIO7)
SDA_FC: H1.2 U7.10(GPIO5)
SPICLK: R11.1 U5.6(CLK) U6.6(SCLK)
SPICS0: R5.1 U5.1(CS#) U7.33(SPICS0)
SPICS1: R6.1 U6.1(CE#) U7.29(SPICS1)
SPID: U5.5(DI（IO0）) U6.5(SI/SIO[0]) U7.36(SPID)
SPIHD: U5.7(IO3) U6.7(SIO[3]) U7.31(SPIHD)
SPIQ: U5.2(DO（IO1）) U6.2(SO/SIO[1]) U7.35(SPIQ)
SPIWP: U5.3(IO2) U6.3(SIO[2]) U7.32(SPIWP)
STATUSLED: STATUS.4(DIN) U7.7(GPIO2)
TXEN: U4.16(TXEN) U7.23(DAC_1)
U0RXD: H3.2 U7.49(U0RXD)
U0TXD: H3.3 U7.48(U0TXD)
USB_D+: U7.26(GPIO20) USB1.3(D+)
USB_D-: U7.25(GPIO19) USB1.2(D-)
XTAL_N: C24.2 U7.52(XTAL_N) X1.3(OSC2)
XTAL_P: R12.2 U7.53(XTAL_P)
Net-(BLINK-2): BLINK.2(K) R8.2
Net-(C8-2): C8.2 JP1.1(SIG) L1.2
Net-(C25-2): C25.2 R12.1 X1.1(OSC1)
Net-(C26-2): C26.2 L3.1 U9.2
Net-(C27-2): C27.2 L3.2 U8.3(RF_IN)
Net-(CN1-1): CN1.1 Q1.3(D)
Net-(PWR-2): PWR.2(K) R7.1
Net-(R11-2): R11.2 U7.34(SPICLK)

Not connected (* = marked no-connect by the designer): CARD1 1(DAT2(RSV))* 8(DAT1(RSV))* 9(CD)*; STATUS 2(DOUT)*; U4 2(DIO5)* 3(DIO4)* 4(DIO3)* 5(DIO2)* 9(NC)*; U7 14(GPIO9)* 19(GPIO14)* 37(GPIO33)* 42(GPIO38)*; U8 7(EP)*; USB1 4(ID)*

## Notes on the sheets
sheet 1
- USB CONNECTOR
- MOUNTING HOLES
- FLIGHT COMPUTER I2C LINES
- AVIONICS I2C LINES
- POWER
- EXTERNAL CAMMERA
- PROGRAMMING UART LINES
- VOLTAGE REGULATOR
- Osodo Rodney
sheet 2
- LORA MODULE
- SD CARD
- LORA ANTENNA
- SD CARD PULL UPS
sheet 3
- BUZZER
- FLASH MEMORY
- STATUS LED
- PSRAM
- FLASH
- PSRAM
- PROGRAMMING SWITCHES
- RESET
- BOOT
sheet 4
- DECOUPLING CAPACITORS
- MCU
- VDDA 1
- VDDA 51
- VDDA 54
- VDDA 20
- VDDA 27
- VDDA 30
- VDDA 45
- CLOCK
- WIFI AMPLIFIER
sheet 5
- JTAG
- WIFI
